# Altium project SIM_NB_IoT.PrjPcb
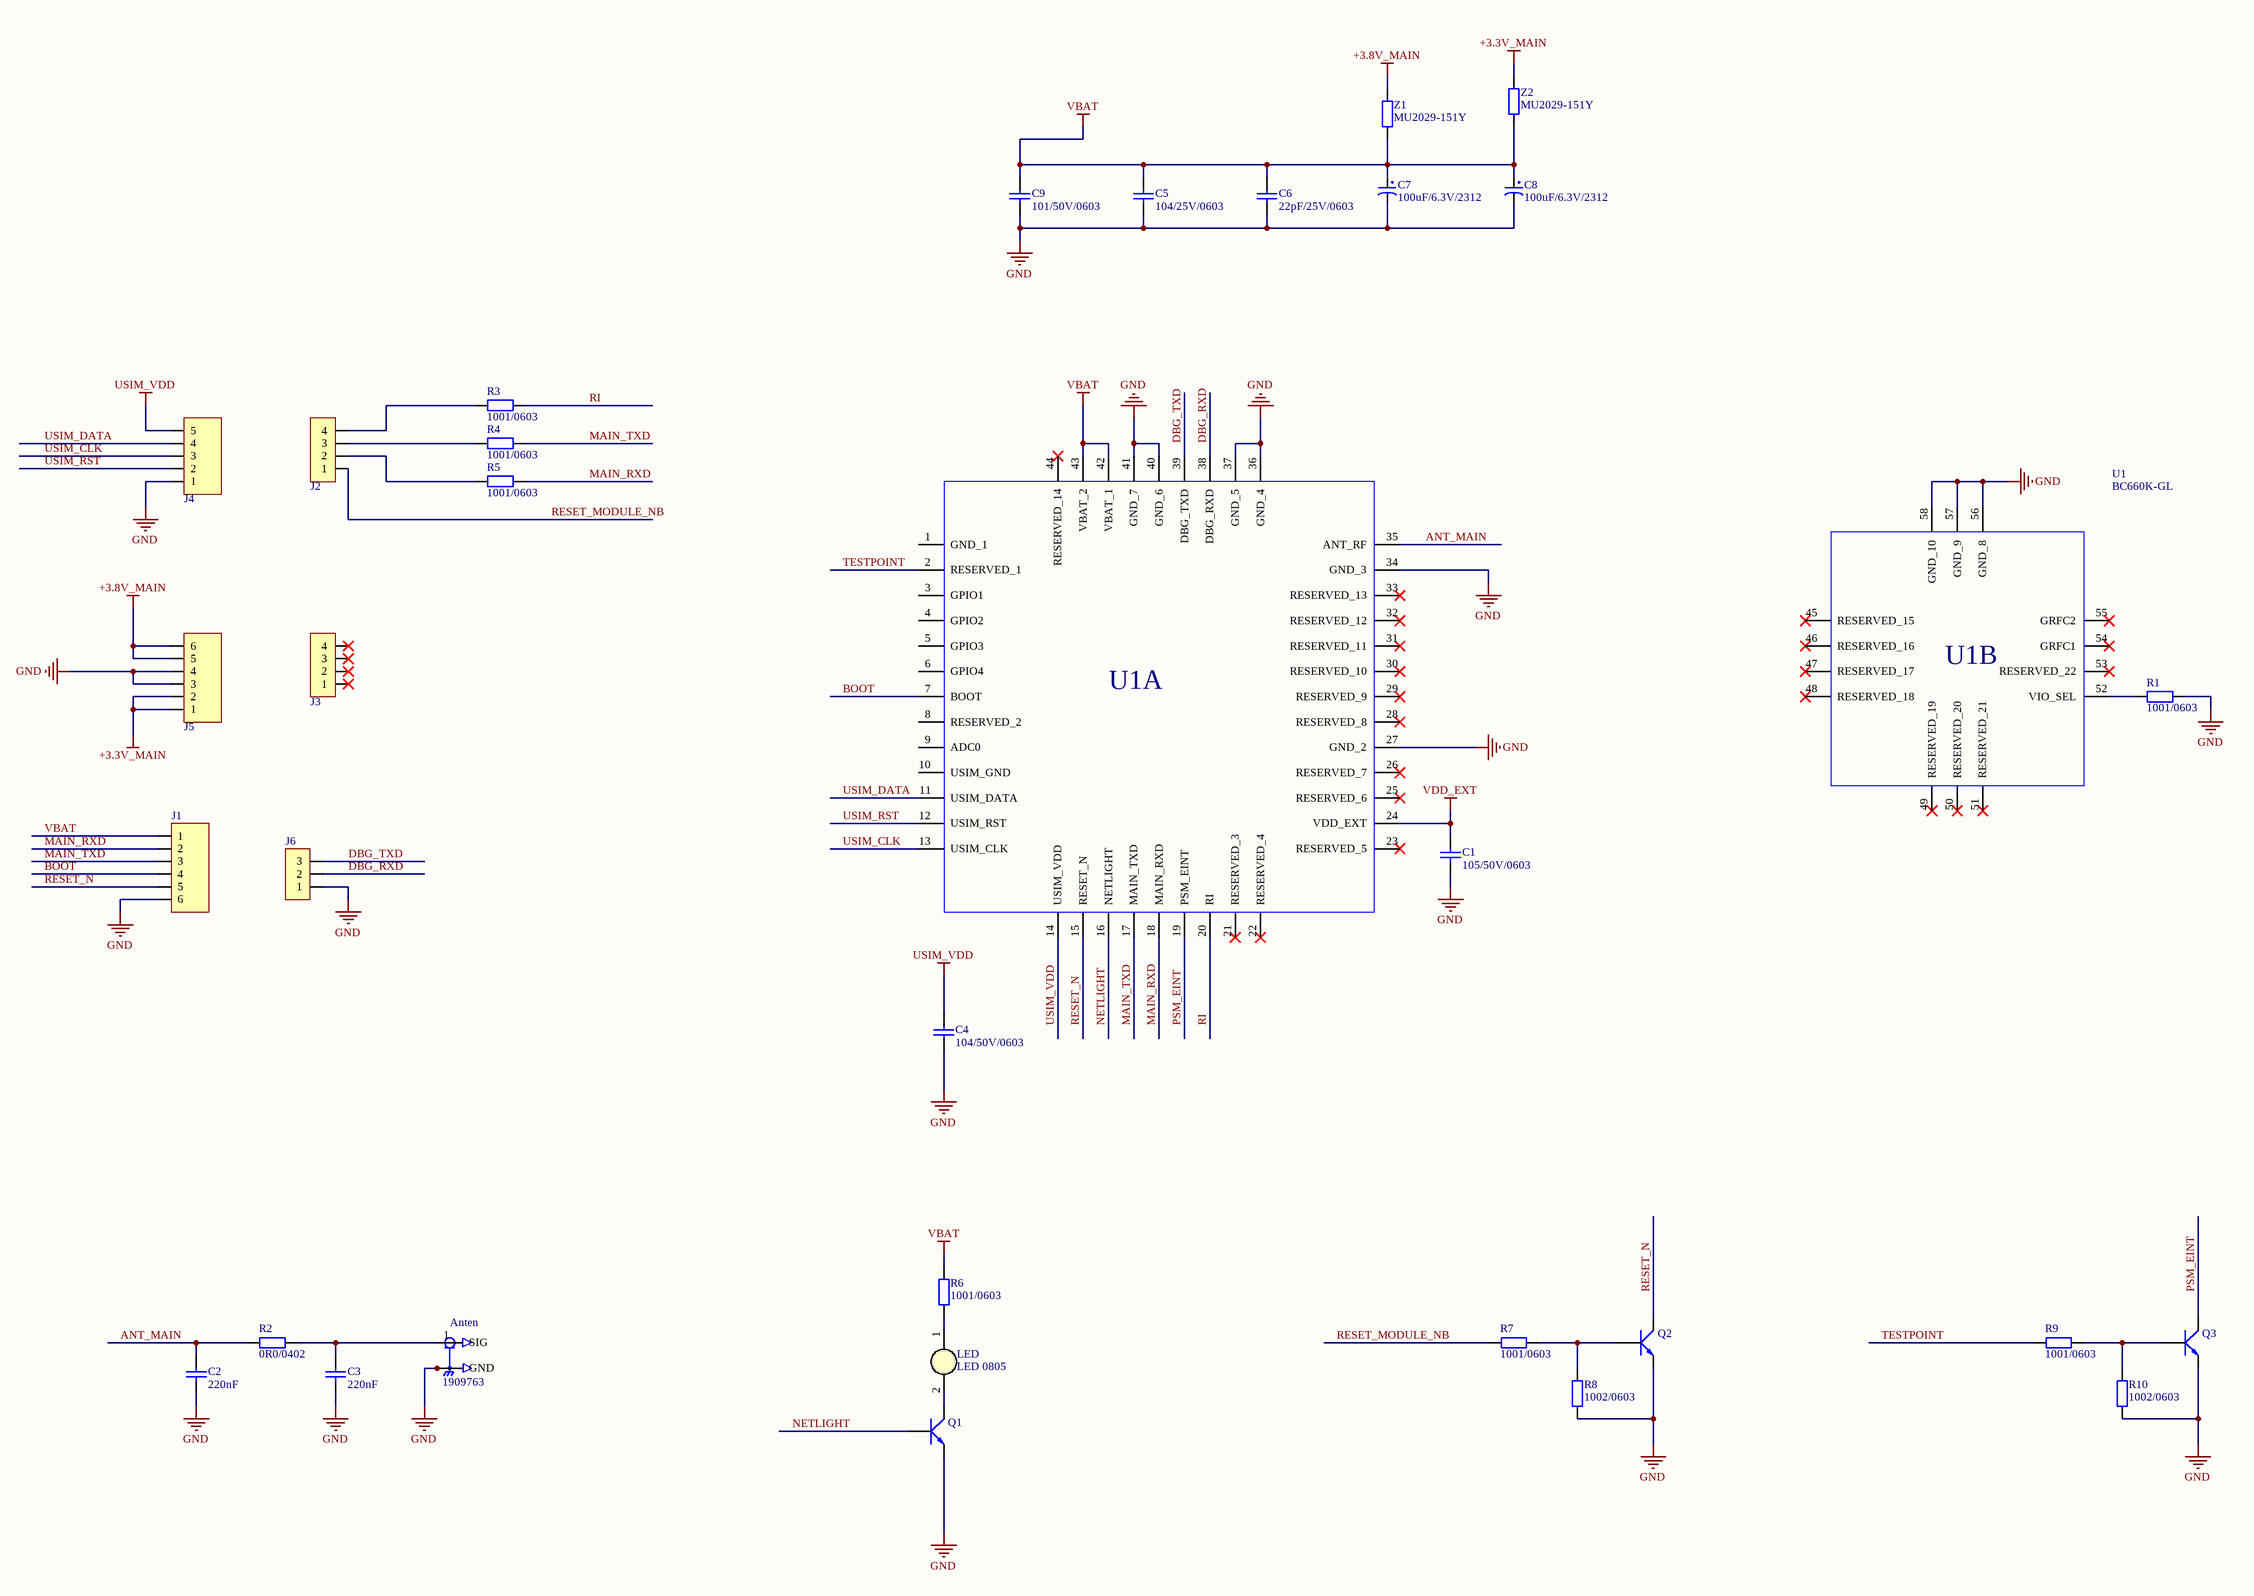
[diagram p0: SIM_NB_IoT.SchDoc]
1 sheet, 33 parts. Net scope: global (net labels, ports and power ports of the same name join across sheets).
Board file: SIM_NB_IoT.PcbDoc

## Sheet SIM_NB_IoT.SchDoc
size A2; SheetNumber: 1; SheetTotal: 1

### Parts
Anten  1909763  [TE_1909763-1]
C1  105/50V/0603  [tu 0603]
C2  220nF  [tu 0402]
C3  220nF  [tu 0402]
C4  104/50V/0603  [tu 0603]
C5  104/25V/0603  [tu 0603]
C6  22pF/25V/0603  [tu 0603]
C7  100uF/6.3V/2312  [tu tantalum smd3216]
C8  100uF/6.3V/2312  [tu tantalum smd3216]
C9  101/50V/0603  [tu 0603]
J1  JP 1x6 2.54  [JP 1x6 DT]  (value not drawn)
J2  JP 1x4 2.54  [JP 1x4 DT]  (value not drawn)
J3  JP 1x4 2.54  [JP 1x4 DT]  (value not drawn)
J4  JP 1x5 2.54  [JP 1x5 DT]  (value not drawn)
J5  JP 1x6 2.54  [JP 1x6 DT]  (value not drawn)
J6  JP 1x3 2.54  [JP 1x3 DT]  (value not drawn)
LED  LED 0805  [LED-0805-Yellow]
Q1  HF  [SOT23]  (value not drawn)
Q2  HF  [SOT23]  (value not drawn)
Q3  HF  [SOT23]  (value not drawn)
R1  1001/0603  [tro smd 0603]
R2  0R0/0402  [tro smd 0603]
R3  1001/0603  [tro smd 0603]
R4  1001/0603  [tro smd 0603]
R5  1001/0603  [tro smd 0603]
R6  1001/0603  [tro smd 0603]
R7  1001/0603  [tro smd 0603]
R8  1002/0603  [tro smd 0603]
R9  1001/0603  [tro smd 0603]
R10  1002/0603  [tro smd 0603]
U1  BC660K-GL  [BC660KGL]
Z1  MU2029-151Y  [MU2029151Y]
Z2  MU2029-151Y  [MU2029151Y]

### Nets
+3.3V_MAIN: J5.1 J5.2 Z2.2
+3.8V_MAIN: J5.5 J5.6 Z1.2
GND: Anten.2(GND) Anten.3(GND) C1.2 C2.1 C3.1 C4.2 C5.2 C6.2 C7.2 C8.2 C9.2 J1.6 J4.1 J5.3 J5.4 J6.1 Q1.2(E) Q2.2(E) Q3.2(E) R1.2 R8.2 R10.2 U1.27(GND_2) U1.34(GND_3) U1.36(GND_4) U1.37(GND_5) U1.40(GND_6) U1.41(GND_7) U1.56(GND_8) U1.57(GND_9) U1.58(GND_10)
USIM_VDD: C4.1 J4.5 U1.14(USIM_VDD)
VBAT: C5.1 C6.1 C7.1 C8.1 C9.1 J1.1 R6.1 U1.42(VBAT_1) U1.43(VBAT_2) Z1.1 Z2.1
VDD_EXT: C1.1 U1.24(VDD_EXT)
ANT_MAIN: C2.2 R2.1 U1.35(ANT_RF)
BOOT: J1.4 U1.7(BOOT)
DBG_RXD: J6.2 U1.38(DBG_RXD)
DBG_TXD: J6.3 U1.39(DBG_TXD)
MAIN_RXD: J1.2 R5.1 U1.18(MAIN_RXD)
MAIN_TXD: J1.3 R4.1 U1.17(MAIN_TXD)
NETLIGHT: Q1.1(B) U1.16(NETLIGHT)
PSM_EINT: Q3.3(C) U1.19(PSM_EINT)
RESET_MODULE_NB: J2.1 R7.2
RESET_N: J1.5 Q2.3(C) U1.15(RESET_N)
RI: R3.1 U1.20(RI)
TESTPOINT: R9.2 U1.2(RESERVED_1)
USIM_CLK: J4.3 U1.13(USIM_CLK)
USIM_DATA: J4.4 U1.11(USIM_DATA)
USIM_RST: J4.2 U1.12(USIM_RST)
NetAnten_1: Anten.1(SIG) C3.2 R2.2
NetJ2_2: J2.2 R5.2
NetJ2_3: J2.3 R4.2
NetJ2_4: J2.4 R3.2
NetLED_1: LED.1(A) R6.2
NetLED_2: LED.2(K) Q1.3(C)
NetQ2_1: Q2.1(B) R7.1 R8.1
NetQ3_1: Q3.1(B) R9.1 R10.1
NetR1_1: R1.1 U1.52(VIO_SEL)

Not connected (* = marked no-connect by the designer): J3 1* 2* 3* 4*; U1 1(GND_1) 3(GPIO1) 4(GPIO2) 5(GPIO3) 6(GPIO4) 8(RESERVED_2) 9(ADC0) 10(USIM_GND) 21(RESERVED_3)* 22(RESERVED_4)* 23(RESERVED_5)* 25(RESERVED_6)* 26(RESERVED_7)* 28(RESERVED_8)* 29(RESERVED_9)* 30(RESERVED_10)* 31(RESERVED_11)* 32(RESERVED_12)* 33(RESERVED_13)* 44(RESERVED_14)* 45(RESERVED_15)* 46(RESERVED_16)* 47(RESERVED_17)* 48(RESERVED_18)* 49(RESERVED_19)* 50(RESERVED_20)* 51(RESERVED_21)* 53(RESERVED_22)* 54(GRFC1)* 55(GRFC2)*

### Notes on the sheet
- (in symbol BC660K-GL) U1B; U1A

### Library data of the parts
Anten = Antenna: VAO ITEM, MINI RF HEADER; MP: 1909763-1; Value: *; Package: None; Availability: Unavailable; Price: None
C1 C4-C6 C9 = Tu 0603 563 16V 10%: Dán; Don_Vi: Con; So_Chan: 2; Ten_Linh_Kien: Tụ 0603 563-56nF 10% 16V; Ma_Hang: MH004573; Chung_Loai: Dán; Kieu_Chan: *
C2 C3 = Tu 0402 220nF 6.3V 20%: Dán; Don_Vi: Con; So_Chan: 2; Ten_Linh_Kien: Tụ 0402 220nF 6.3V 20%; Ma_Hang: MH008102; Chung_Loai: Dán; Kieu_Chan: *
C7 C8 = Tu tantalum 10uF 16V SMD3216: Dán; Don_Vi: Con; So_Chan: 2; Ten_Linh_Kien: Tụ tantalum 106C-10uF 16V SMD3216; Ma_Hang: MH001954; Chung_Loai: Dán; Kieu_Chan: *
J1 J5 = JP 1x6 2.54 Duc Thang: Cắm; Ten_Linh_Kien: Jump Đơn Đực 2.54MM 1x40P Thẳng 11MM; Don_Vi: Con; Ma_Hang: MH000903; Ghi_Chu: *; Kieu_Chan: *; Chung_Loai: Cắm
J2 J3 = JP 1x4 2.54 Duc Thang: Cắm; Ten_Linh_Kien: Jump Đơn Đực 2.54MM 1x40P Thẳng 11MM; Don_Vi: Con; Ma_Hang: MH000903; Ghi_Chu: *; Kieu_Chan: *; Chung_Loai: Cắm
J4 = JP 1x5 2.54 Duc Thang: Cắm; Ten_Linh_Kien: Jump Đơn Đực 2.54MM 1x40P Thẳng 11MM; Don_Vi: Con; Ma_Hang: MH000903; Ghi_Chu: *; Kieu_Chan: *; Chung_Loai: Cắm
J6 = JP 1x3 2.54 Duc Thang: Cắm; Ten_Linh_Kien: Jump Đơn Đực 2.54MM 1x40P Thẳng 11MM; Don_Vi: Con; Ma_Hang: MH000903; Ghi_Chu: *; Kieu_Chan: *; Chung_Loai: Cắm
LED = LED 0805 Trang: Dán; Don_Vi: Con; Ma_Hang: MH002946; Ten_Linh_Kien: LED 0805 Màu Trắng ( White); Ghi_Chu: *; Kieu_Chan: *; Chung_Loai: Dán
Q1-Q3 = C1815 HF SMD: NPN transistor; Value: C9014
R1-R10 = Tro 0603 5% 510R: Dán; Don_Vi: Con; So_Chan: 2; Ten_Linh_Kien: Trở 0603 5% 510R; Ma_Hang: MH007667; Chung_Loai: Dán; Kieu_Chan: *
U1 = BC660K-GL: Compact NB-IoT Module with Ultra-low Power Consumption LTE Cat NB2 2.2V to 4.3V 16.7kbps/158.5kbps 58-Pin LCC - Tape and Reel; Manufacturer_Name: Quectel; Geometry.Height: 2.2mm; Manufacturer_Part_Number: BC660K-GL; Mouser Part Number: *; Mouser Price/Stock: *; Arrow Part Number: *; Arrow Price/Stock: *; Mouser Testing Part Number: *; Mouser Testing Price/Stock: *; Datasheet Link: https://www.quectel.com/wp-content/uploads/2021/04/Quectel_BC660K-GL_Hardware_Design_V1.0.pdf
Z1 Z2 = MU2029-151Y: 150 Ohms @ 100 MHz 1 Power, Signal Line Ferrite Bead 0805 (2012 Metric) 800mA 200mOhm; Manufacturer_Name: Bourns; Geometry.Height: 1.1mm; Manufacturer_Part_Number: MU2029-151Y; Mouser Part Number: 652-MU2029-151Y; Mouser Price/Stock: https://www.mouser.co.uk/ProductDetail/Bourns/MU2029-151Y?qs=9FzDyaD7ZFCqd2lEExIVWQ%3D%3D; Arrow Part Number: MU2029-151Y; Arrow Price/Stock: https://www.arrow.com/en/products/mu2029-151y/bourns; Mouser Testing Part Number: *; Mouser Testing Price/Stock: *; Datasheet Link: https://www.bourns.com/docs/Product-Datasheets/mgmumz.pdf